# Altium schematic sheet RF-learn-command-1relay-220V-capacitor.SchDoc
size A
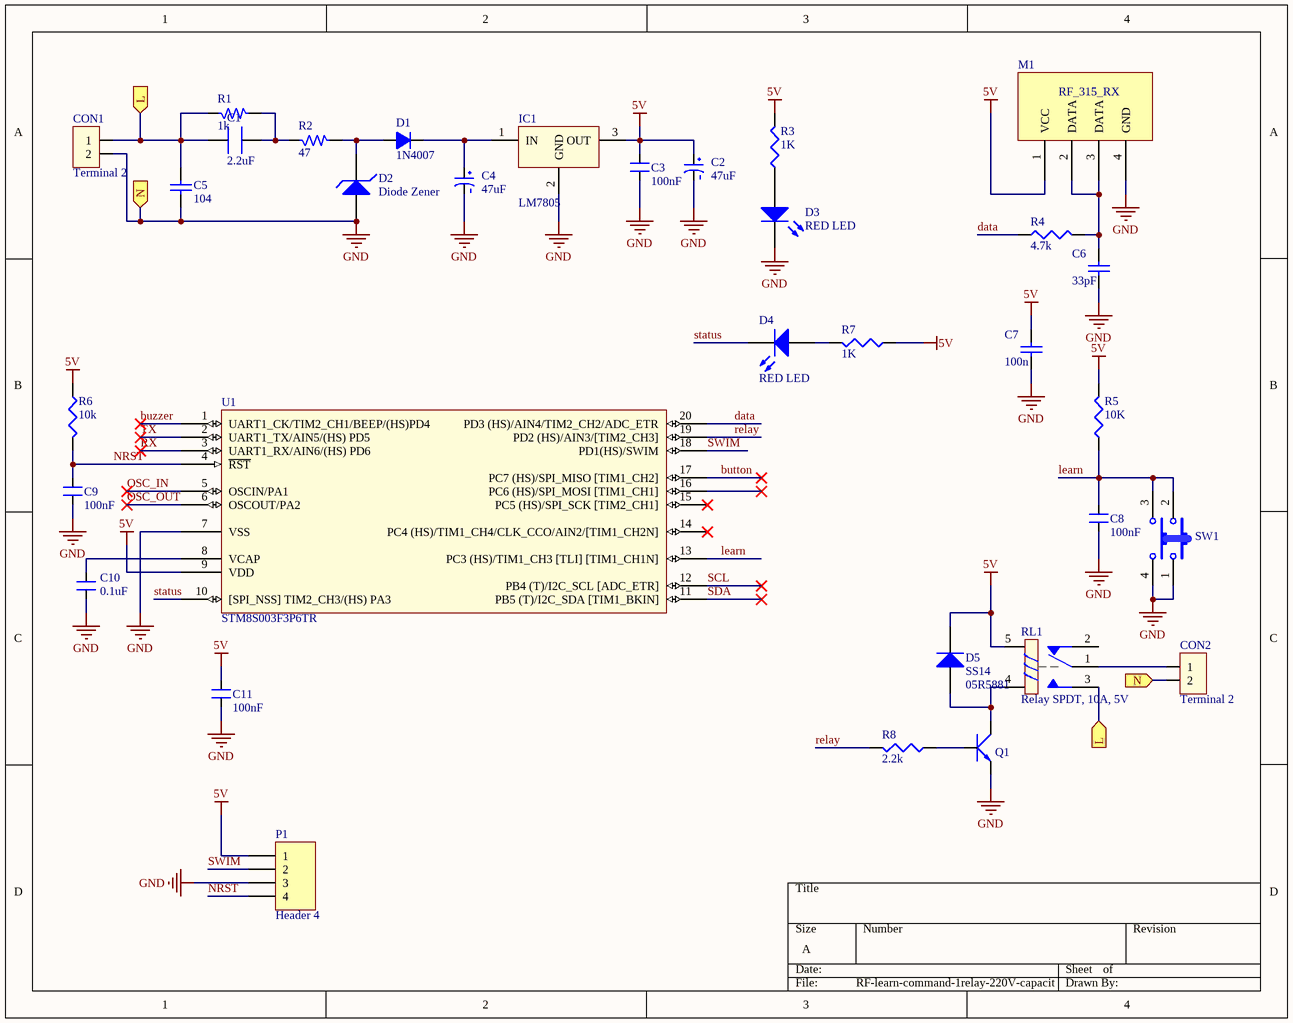
[diagram p0: RF-learn-command-1relay-220V-capacitor.SchDoc]

## Parts
C1  2.2uF  [CAP 400V POLY]
C2  47uF  [Capacitor 6.3]
C3  100nF  [CM 0805]
C4  47uF  [Capacitor 6.3]
C5  value 104  [C_Ceramic_KV]  (hidden comment: Cap1)
C6  33pF  [CM 0805]
C7  100n  [CM 0805]
C8  100nF  [CM 0805]
C9  100nF  [CM 0805]
C10  0.1uF  [CM 0805]
C11  100nF  [CM 0805]
CON1  Terminal 2  [Terminal 2 5.08]
CON2  Terminal 2  [Terminal 2 5.08]
D1  1N4007  [DO-214AC]
D2  Diode Zener  [SOD-123]
D3  RED LED  [LED0805-R]
D4  RED LED  [LED3mm-Y]
D5  SS14  Supplier Part Number 1: 05R5881  [DO-214AC (SMA)]
IC1  LM7805  [TO-252-3-L1]
M1  RF_315_RX  [Module-RF-RX]
P1  Header 4  [HDR1X4]
Q1  C1815  [2SC1815]  (value not drawn)
R1  1k  [R 1/4W]
R2  47  [R 1WD]
R3  1K  [R0805]
R4  4.7k  [R0805]
R5  10K  [R0805]
R6  10k  [R0805]
R7  1K  [R0805]
R8  2.2k  [R0805]
RL1  Relay SPDT, 10A, 5V  [RL_SPDT_10A]
SW1  SW-4P-S  [SW4]  (value not drawn)
U1  STM8S003F3P6TR  [SSOP-20]

## Ports
L (in), N (in)

## Nets
5V: C2.1 C3.2 C7.1 C11.2 D5.2(K) IC1.3(OUT) M1.1(VCC) P1.1 R3.2 R5.2 R6.1 R7.1 RL1.5 U1.9(VDD)
GND: C2.2 C3.1 C4.2 C5.1 C6.2 C7.2 C8.1 C9.1 C10.1 C11.1 CON1.2 CON2.2 D2.2(A) D3.2(K) IC1.2(GND) M1.4(GND) P1.3 Q1.2(E) SW1.1 SW1.4 U1.7(VSS) ; port N
button: U1.17(PC7_(HS)/SPI_MISO_[TIM1_CH2])
buzzer: U1.1(UART1_CK/TIM2_CH1/BEEP/(HS)PD4)
data: R4.1 U1.20(PD3_(HS)/AIN4/TIM2_CH2/ADC_ETR)
L: C1.1 C5.2 CON1.1 R1.1 RL1.3 ; port L
learn: C8.2 R5.1 SW1.2 SW1.3 U1.13(PC3_(HS)/TIM1_CH3_[TLI]_[TIM1_CH1N])
NRST: C9.2 P1.4 R6.2 U1.4(~{RST})
OSC_IN: U1.5(OSCIN/PA1)
OSC_OUT: U1.6(OSCOUT/PA2)
relay: R8.2 U1.19(PD2_(HS)/AIN3/[TIM2_CH3])
RX: U1.3(UART1_RX/AIN6/(HS)_PD6)
SCL: U1.12(PB4_(T)/I2C_SCL_[ADC_ETR])
SDA: U1.11(PB5_(T)/I2C_SDA_[TIM1_BKIN])
status: D4.2(K) U1.10([SPI_NSS]_TIM2_CH3/(HS)_PA3)
SWIM: P1.2 U1.18(PD1(HS)/SWIM)
TX: U1.2(UART1_TX/AIN5/(HS)_PD5)
NetC1_2: C1.2 R1.2 R2.1
NetC4_1: C4.1 D1.1(K) IC1.1(IN)
NetC6_1: C6.1 M1.2(DATA) M1.3(DATA) R4.2
NetC10_2: C10.2 U1.8(VCAP)
NetCON2_1: CON2.1 RL1.1
NetD1_2: D1.2(A) D2.1(K) R2.2
NetD3_1: D3.1(A) R3.1
NetD4_1: D4.1(A) R7.2
NetD5_1: D5.1(A) Q1.3(C) RL1.4
NetQ1_1: Q1.1(B) R8.1

Not connected (* = marked no-connect by the designer): RL1 2; U1 14(PC4_(HS)/TIM1_CH4/CLK_CCO/AIN2/[TIM1_CH2N])* 15(PC5_(HS)/SPI_SCK_[TIM2_CH1])* 16(PC6_(HS)/SPI_MOSI_[TIM1_CH1])*

## Notes on the sheet
- (in symbol CAP DIP) -

## Library data of the parts
C1 = CAP Polyester: DIP Electrolytic Capacitors; Manufacturer No: 1uF/400V; Capacitance: 1uF; Voltage: 400V; Tolerance: 20%; Specification: ="Capacitance"+" "+"Voltage"
C2 C4 = CAP DIP: DIP Electrolytic Capacitors; Manufacturer No: 47uF/35V (JWCO); Manufacturer: JWCO; Voltage: 35V; Tolerance: 20%; Capacitance: 47uF; Specification: ="Capacitance"+" "+"Voltage"+" " +"Tolerance"
C3 C8-C11 = CM Ceramic: SMD Ceramic  Capacitor; Manufacturer No: C0805KRX7R9BB104; Manufacturer: Yageo; Voltage: 50V; Tolerance: 10%; Specification: ="Capacitance"+" "+"Voltage"+" " +"Tolerance"
  C3 C8 C9 C11: Capacitance: 100nF
  C10: Capacitance: 0.1uF
C5 = Cap1: Polar Capacitor; Published: 8-Jun-2000; LatestRevisionDate: 17-Jul-2002; LatestRevisionNote: Re-released for DXP Platform.; PackageReference: RAD-0.3; Publisher: Altium Limited; PackageDescription: Radial Cap, Thru-Hole; 2 Leads; 0.3 in Pin Spacing
C6 C7 = Cap Semi: Capacitor 100n 16V 0603; Published: 8-Jun-2000; LatestRevisionDate: 29-May-2009; LatestRevisionNote: IPC-7351 Footprint Added.; PackageReference: C1206; Publisher: Altium Limited; PackageDescription: Chip Capacitor
CON1 CON2 = Terminal 2: Value: Connector 2
D1 = Diodes Rectifier: 1N4007 Rectifier Diodes; Manufacturer: SYC; Specification: RMS Reverse Voltage 700V, Max Current 1A; Manufacturer No: 1N4007
D2 = Diode Zener: Zener Voltage Regulators; Manufacturer No: MMSZ5222BT1G; Manufacturer: ON Semiconductor; Specification: 500 mW SOD−123 Surface Mount
D3 D4 = LED2: LED SUPR RED CLR 0805 RT ANG SMD; Manufacturer: Lite-On Inc; Manufacturer Part Number: LTST-S220KRKT; Value: LED RED; Published: 8-Jun-2000; LatestRevisionDate: 17-Jul-2002; LatestRevisionNote: Re-released for DXP Platform.; PackageVersion: Feb-2002; PackageReference: 3.2X1.6X1.1; Publisher: Altium Limited; Digi-Key Part Number: 160-1469-2-ND; Unit Price: 0.03780
D5 = Diode: DIODE GEN PURPOSE 1000V 1A SMA; Manufacturer Part Number: CGRA4007-G; Manufacturer: Comchip Technology; Value: 1N4007; Published: 8-Jun-2000; LatestRevisionDate: 17-Jul-2002; LatestRevisionNote: Re-released for DXP Platform.; PackageVersion: Sep-1996; PackageReference: DO-214-AA; Publisher: Altium Limited; Code_JEDEC: DO-214-AB; Digi-Key Part Number: 641-1018-1-ND; Unit Price: 0.05130; Supplier 1: Newark
IC1 = LM78xx: On ap +, from + 5 to + 24VDC; Value: LM7805
M1 = ModuleRF-RX
P1 = Header 4: Header, 4-Pin; LatestRevisionDate: 17-Jul-2002; LatestRevisionNote: Re-released for DXP Platform.; Publisher: Altium Limited
Q1 = C1815: NPN SMD Transistor; Manufacturer No: 2SC1815-HF; Manufacturer: Toshiba; Vendor: BL Galaxy Electrical; Vendor_Vietnam: TME; Value: C1815; Specification: C1815
R1 = R1/4W: Resistor 1/4W DIP; Value: R1/4W - 1K
R2 = R1/2W: Resistor 1/2W DIP; Manufacturer No: RM10JTN102; Manufacturer: UniOhm; Power Rating: 1/10W; Value: 47; Specification: ="Value" + "  "+ "Power Rating"
R3 R5 R7 = Res3: Resistor 10k 0603; Published: 8-Jun-2000; LatestRevisionDate: 29-May-2009; LatestRevisionNote: IPC-7351 Footprint Added.; PackageReference: J1-0603; Publisher: Altium Limited; PackageDescription: Chip Resistor
R4 R8 = Res3: Resistor; Manufacturer: Vishay / Draloric; Manufacturer Part Number: RCV0805301KFKEA; Value: 10k; Power Rating: 125 mW (1/8 W); Resistance: 301 kOhms; Temperature Coefficient: 100 PPM / K; Tolerance: 1 %; Voltage Rating: 400 V; Case Height: 0.45 mm; Case Length: 2 mm; Case Width: 1.25 mm; Product Status: New Product; Published: 8-Jun-2000; LatestRevisionDate: 29-May-2009; LatestRevisionNote: IPC-7351 Footprint Added.; PackageReference: J1-0603; Publisher: Altium Limited; PackageDescription: Chip Resistor; Supplier 1: Mouser; Supplier Part Number 1: 71-RCV0805301KFKEA; RoHS: RoHS Compliant; Category: Thick Film Resistors - SMD; Stock 1: 5000; Pricing 1: 1=0.330, 50=0.177, 100=0.102, 500=0.069, 1000=0.054, 5000=0.051, 10000=0.048, 15000=0.040, 25000=0.033 (USD); Operating Temperature Range: - 55 C to + 155 C; Package / Case: 0805 (2012 metric); Packaging: Reel; Product: Thick Film Resistors SMD; Series: RCV; Case Code - in: 0805; Case Code - mm: 2012; Product Category: 0805 Thick Film Chip Resistors; RoHS - Mouser: Y; Minimum Order Quantity: 1; Reeling: True; ComponentLink1URL: http://www.vishay.com/docs/20054/rcve3.pdf; ComponentLink1Description: http://www.vishay.com/docs/20054/rcve3.pdf
R6 = Res3: Resistor; Manufacturer: Vishay / Draloric; Manufacturer Part Number: RCV0805301KFKEA; Power Rating: 125 mW (1/8 W); Resistance: 301 kOhms; Temperature Coefficient: 100 PPM / K; Tolerance: 1 %; Voltage Rating: 400 V; Case Height: 0.45 mm; Case Length: 2 mm; Case Width: 1.25 mm; Product Status: New Product; Published: 8-Jun-2000; LatestRevisionDate: 29-May-2009; LatestRevisionNote: IPC-7351 Footprint Added.; PackageReference: J1-0603; Publisher: Altium Limited; PackageDescription: Chip Resistor; Value: 10k; Supplier 1: Mouser; Supplier Part Number 1: 71-RCV0805301KFKEA; RoHS: RoHS Compliant; Category: Thick Film Resistors - SMD; Stock 1: 5000; Pricing 1: 1=0.330, 50=0.177, 100=0.102, 500=0.069, 1000=0.054, 5000=0.051, 10000=0.048, 15000=0.040, 25000=0.033 (USD); Operating Temperature Range: - 55 C to + 155 C; Package / Case: 0805 (2012 metric); Packaging: Reel; Product: Thick Film Resistors SMD; Series: RCV; Case Code - in: 0805; Case Code - mm: 2012; Product Category: 0805 Thick Film Chip Resistors; RoHS - Mouser: Y; Minimum Order Quantity: 1; Reeling: True; ComponentLink1URL: http://www.vishay.com/docs/20054/rcve3.pdf; ComponentLink1Description: http://www.vishay.com/docs/20054/rcve3.pdf
RL1 = Relay 1: Relay SPDT,10A - 12VDC 5 Pin; Value: Relay SPDT, 10A, 5V
SW1 = SW-4PIN-SMALL: Switch Small 4 Pin; Published: 24-Mar-1999; LatestRevisionDate: 17-Jul-2002; LatestRevisionNote: Re-released for DXP Platform.; PackageReference: SPST-2; Publisher: Altium Limited
U1 = STM8S003F3: MCU; Manufacturer: STMicroelectronics; Program Memory Type: Flash; A/D Bit Size: 10 bit; A/D Channels Available: 5; Data RAM Size: 1 KB; Data ROM Size: 128 B; Interface Type: I2C, SPI, UART; Program Memory Size: 8 KB; Core: STM8; Data Bus Width: 8 bit; Maximum Clock Frequency: 16 MHz; Number of Timers: 3; On-Chip ADC: Yes; On-Chip DAC: No; Operating Supply Voltage: 2.95 V to 5.5 V; Supply Voltage - Max: 5.5 V; Supply Voltage - Min: 2.95 V; Product Status: New Product; Supplier 1: Mouser; Supplier Part Number 1: 511-STM8S003F3P6TR; Manufacturer Part Number: STM8S003F3P6TR; RoHS: RoHS Compliant; Category: 8-bit Microcontrollers - MCU; Stock 1: 2832; Pricing 1: 1=0.910, 10=0.703, 100=0.559, 500=0.510, 1000=0.390, 2500=0.346, 10000=0.332, 25000=0.322 (USD); Package / Case: TSSOP-20; Packaging: Reel; Mounting Style: SMD/SMT; Maximum Operating Temperature: + 85 C; Minimum Operating Temperature: - 40 C; RoHS - Mouser: Y; Minimum Order Quantity: 1; Reeling: True; ComponentLink1URL: http://www.st.com/web/catalog/mmc/FM141/SC1244/SS1010/LN2/PF251792?referrer=70032480; ComponentLink1Description: http://www.st.com/web/catalog/mmc/FM141/SC1244/SS1010/LN2/PF251792?referrer=70032480; Supplier 2: Digi-Key